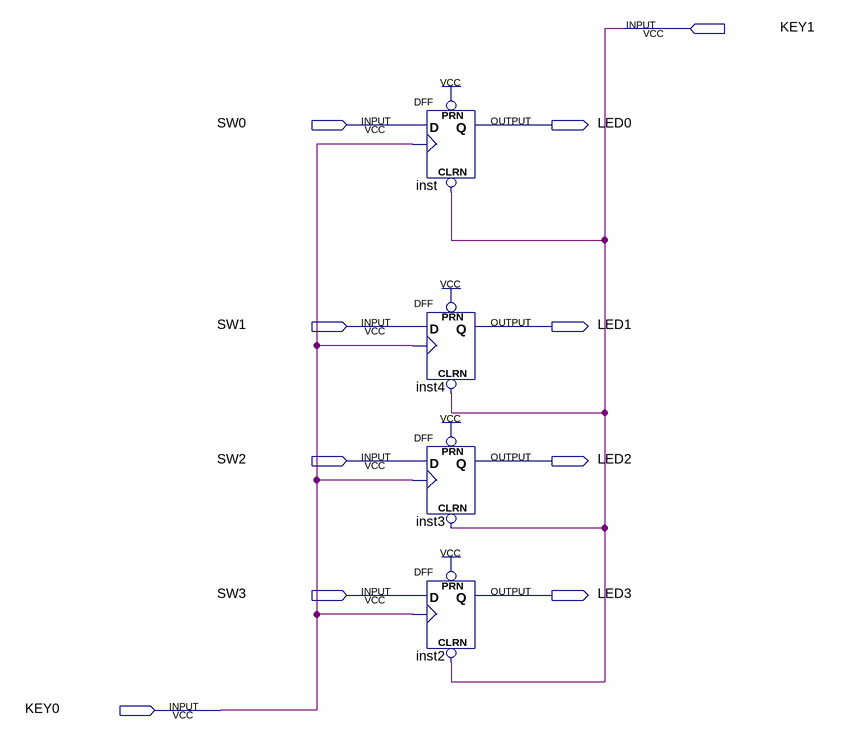
[diagram p0: schematic sheet]
// Quartus schematic Reg4Bit.bdf as structural Verilog: 4 symbols, 10 pins
module Reg4Bit (
  input  KEY1,
  input  SW0,
  input  SW1,
  input  SW2,
  input  SW3,
  input  KEY0,
  output LED0,
  output LED1,
  output LED2,
  output LED3
);

  DFF inst (.CLRN(KEY1), .CLK(KEY0), .D(SW0), .PRN(1'b1), .Q(LED0));
  DFF inst4 (.CLRN(KEY1), .CLK(KEY0), .D(SW1), .PRN(1'b1), .Q(LED1));
  DFF inst3 (.CLRN(KEY1), .CLK(KEY0), .D(SW2), .PRN(1'b1), .Q(LED2));
  DFF inst2 (.CLRN(KEY1), .CLK(KEY0), .D(SW3), .PRN(1'b1), .Q(LED3));
endmodule
